# EAGLE design NanoHat-SPDIF (EAGLE 6.5.0)
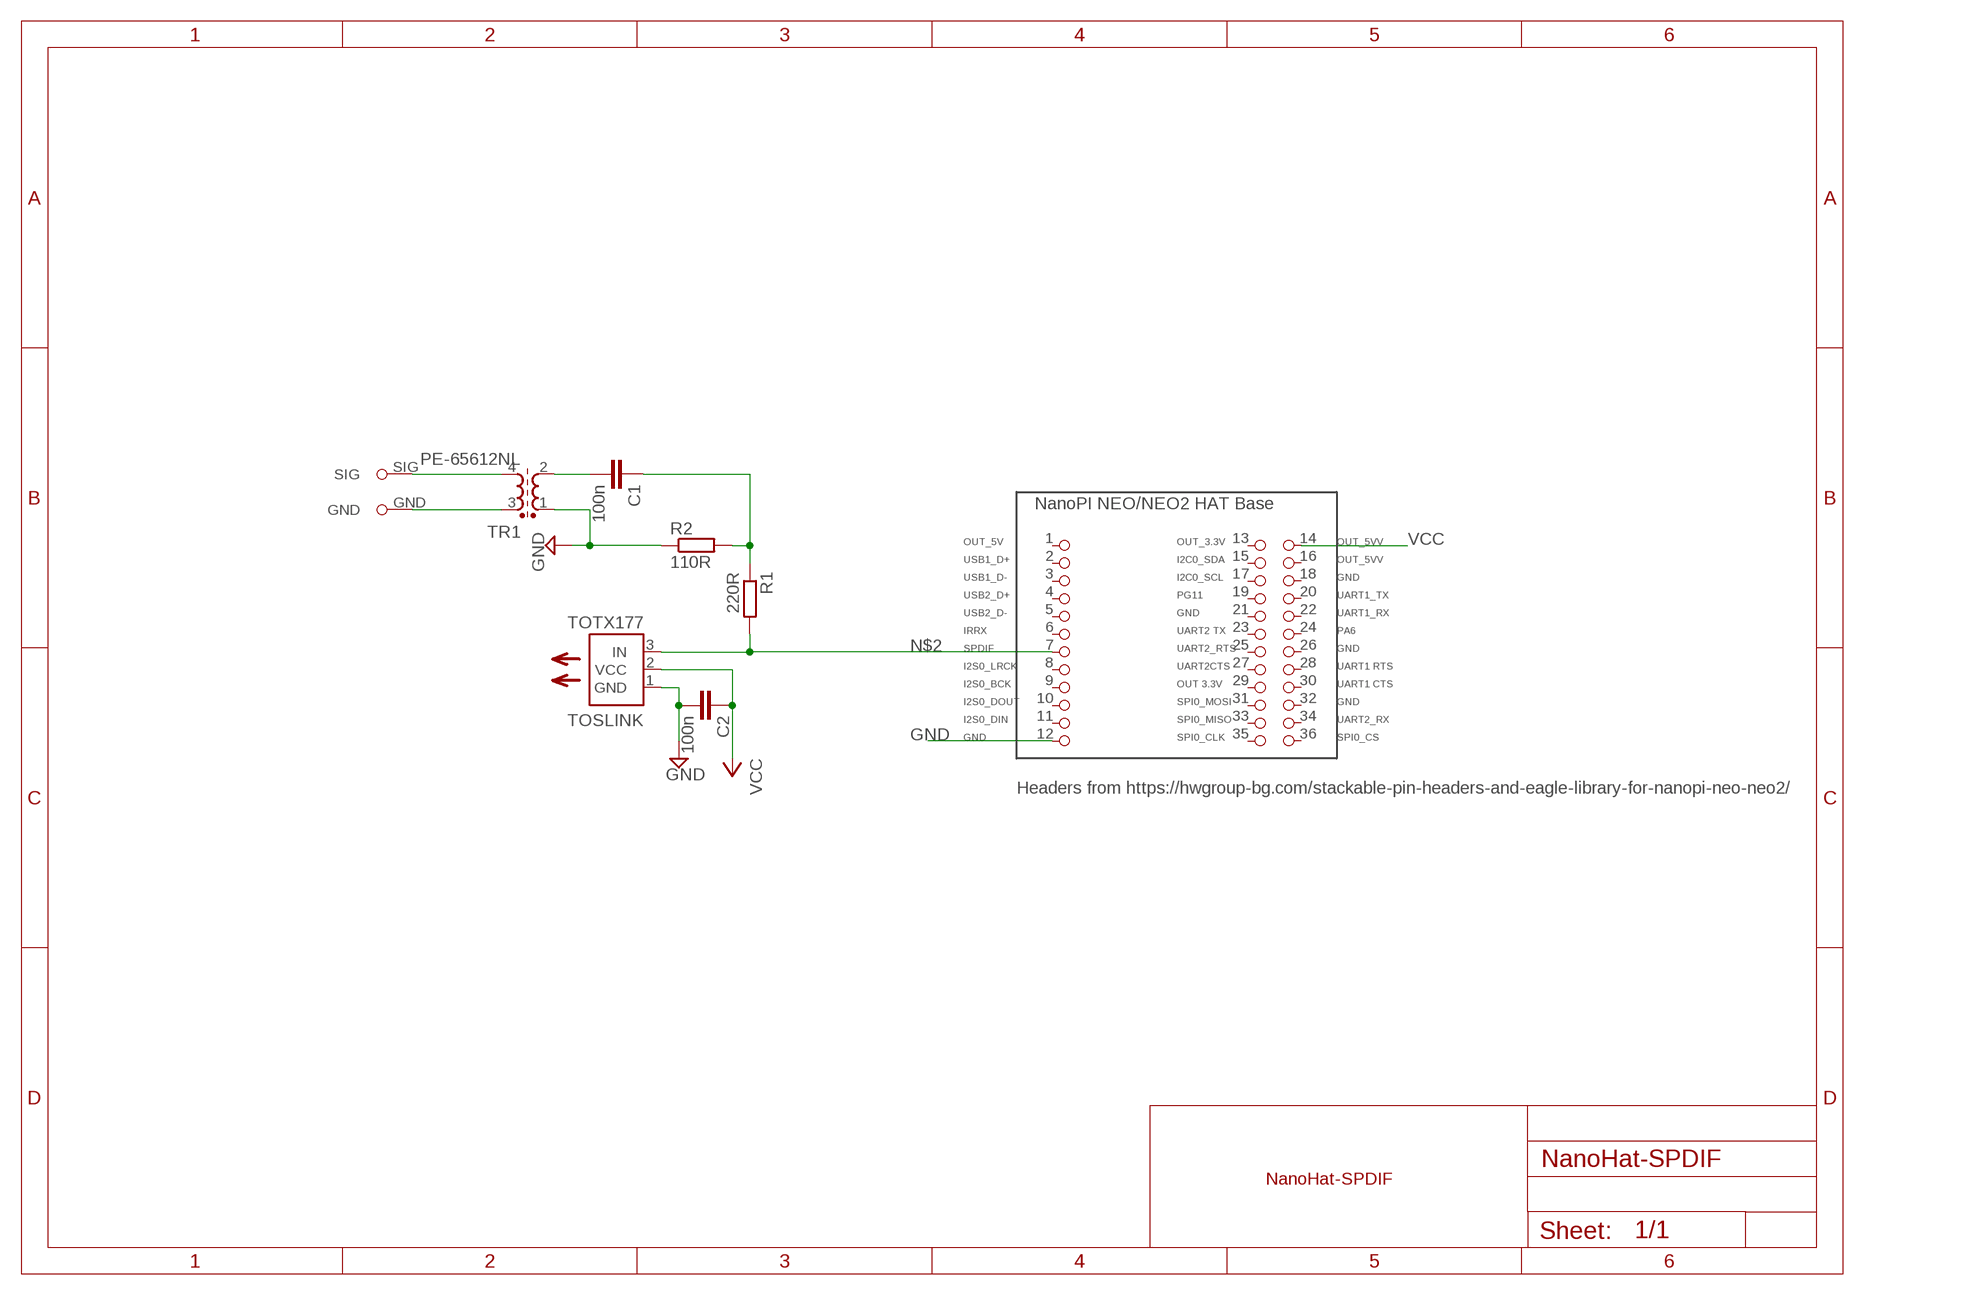
[diagram p0: schematic, sheet 1]

## Parts
C1  100n  C-EU025-024X044  [C025-024X044]
C2  100n  C-EU025-024X044  [C025-024X044]
R1  220R  R-EU_R0805  [R0805]
R2  110R  R-EU_R0805  [R0805]
TOSLINK  TOTX177  TOTX177(F,T)  [TOTX]
TR1  PE-65612NL  S22083  [S22083]
U$1  NANO  [NANOPI_NEO_HAT]
U$2  AV-8.4-5  [AUDIO]

## Nets
GND: C2.2 R2.1 TOSLINK.1(GND) TR1.1 U$1.12(GND_12)
GROUND: TR1.3 U$2.GND
N$1: C1.2 TR1.2
N$2: R1.2 TOSLINK.3(IN) U$1.7(SPDIF_P_7)
N$3: C1.1 R1.1 R2.2
SIG: TR1.4 U$2.SIG
VCC: C2.1 TOSLINK.2(VCC) U$1.14(OUT_5V_14)
Unconnected: U$1.1(OUT_5V_P1) U$1.2(USB_1_D+_2) U$1.3(USB_1_D-_3) U$1.4(USB_2_D+_4) U$1.5(USB_2_D-_5) U$1.6(IR_RX_6) U$1.8(LRCK_8) U$1.9(BCK_9) U$1.10(DOUT_10) U$1.11(DIN_11) U$1.13(OUT_3.3V_13) U$1.15(I2C0_SDA_15) U$1.16(OUT_5V_16) U$1.17(I2C0_SCL_17) U$1.18(GND_18) U$1.19(PG11_19) U$1.20(UART1_TX_20) U$1.21(GND_21) U$1.22(UART1_RX_22) U$1.23(UART2TX_23) U$1.24(PA6_24) U$1.25(UART2_RTS_25) U$1.26(GND26) U$1.27(UART2_CTS_27) U$1.28(UART1_RTS_28) U$1.29(3V3_29) U$1.30(UART1_CTS_30) U$1.31(MOSI_31) U$1.32(GND_32) U$1.33(SPI0_MISO_33) U$1.34(UART2_RX_34) U$1.35(SPI0_CLK_35) U$1.36(SPI_0_CS_36)

## Notes on the sheet
- Headers from https://hwgroup-bg.com/stackable-pin-headers-and-eagle-library-for-nanopi-neo-neo2/
- NanoHat-SPDIF

## Library data of the parts
C1 C2 = rcl:C-EU: CAPACITOR, European symbol
R1 R2 = rcl:R-EU_: RESISTOR, European symbol
TOSLINK = pavouk2lbr:TOTX177(F,T): FIBER OPTIC TRANSMITTING MODULE
TR1 = pavouk2lbr:S22083: Newava S22083 1:1 Pulse transformer
U$1 = nanopi_neo_hat:NANO: NanoPi NEO/NEO2 Hat Template; SPDIF: SPDIF
U$2 = AV-8.4-5-AUDIO-EAGLE:AV-8.4-5

## Board
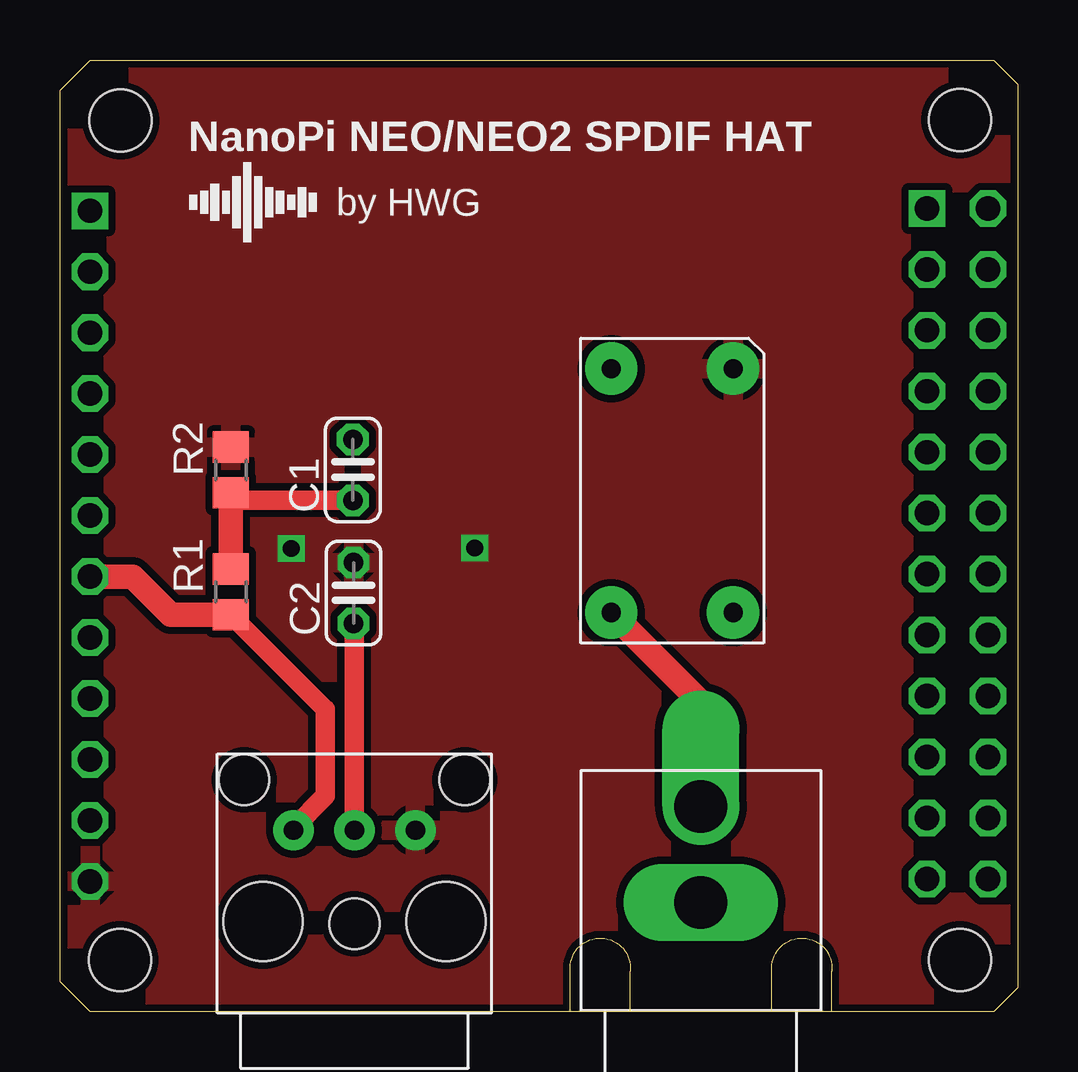
[diagram p1: board, top side]
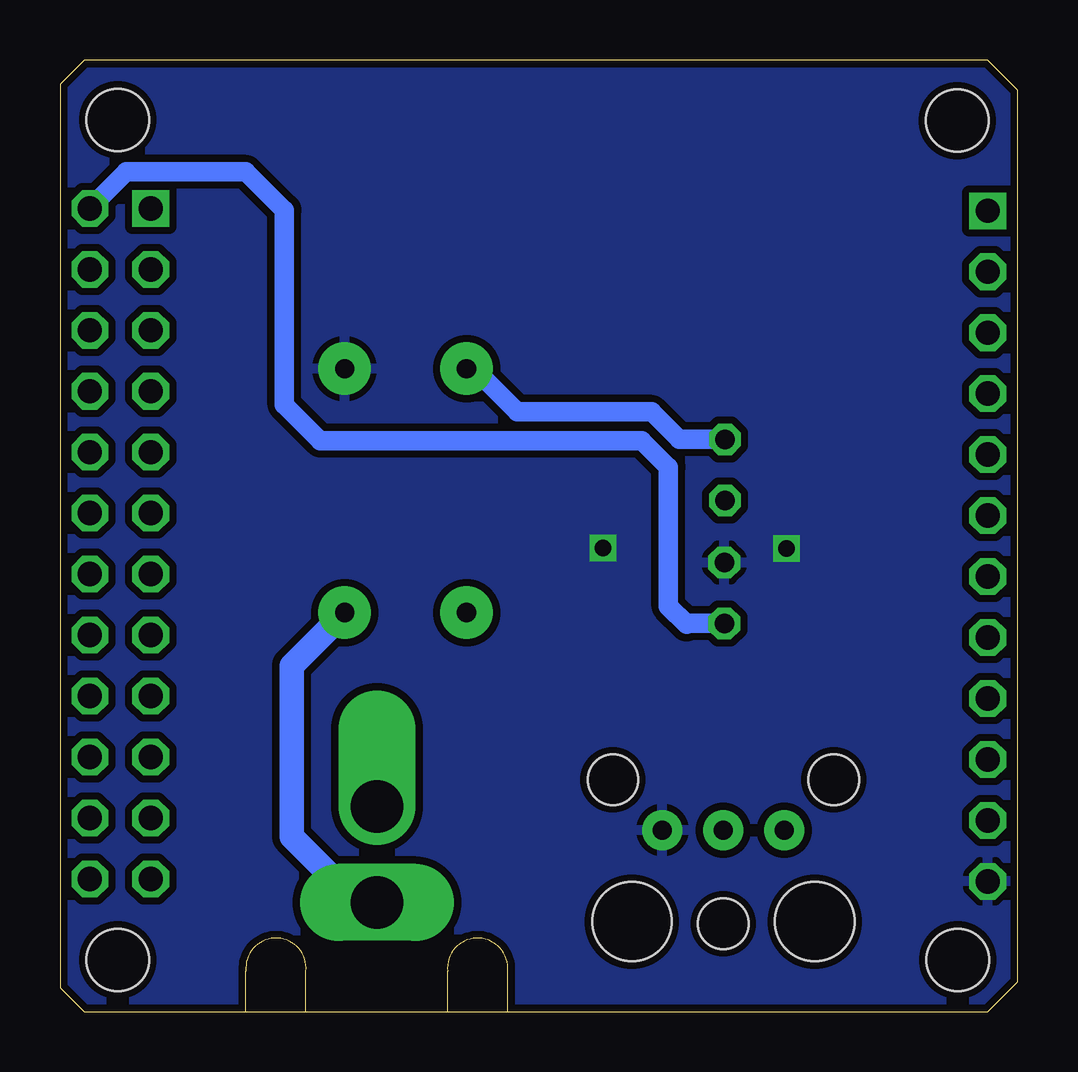
[diagram p2: board, bottom side, seen from below]

Size 39.91 x 39.66 mm. Coordinates in mm from the lower left corner, seen from the top.
Outline: 21.26,0 21.26,1.7 arc-191 23.76,1.7 23.76,0
Outline: 29.66,0 29.66,1.7 arc-191 32.16,1.7 32.16,0
Copper layers (1*16): Top 0.035mm / dielectric 1mm / Bottom 0.035mm
Design rules "default *": minimum track width 10mil, minimum drill 24mil, track to track 12mil, track to pad 12mil, pad to pad 12mil, via to via 12mil, smd to smd 10mil, copper to edge 12mil, drill to drill 8mil, minimum pad ring 10mil, minimum via ring 8mil, stop-mask expansion 4mil, vias tented up to drill 0mil, thermal gap 10mil
Holes 2.6 mm at 2.5,2.16 37.5,2.16 2.52,37.14 37.5,37.16

### Footprints (pad centres in the part's own frame; a part is rotated, then mirrored left to right if it is on the bottom)
C025-024X044 = drill 0.813 octagon: 1 -1.27,0; 2 1.27,0
R0805 = smd 1.3 x 1.5: 1 -0.95,0; 2 0.95,0
TOTX = drill 0.8 pad 1.676: 1 -3.81,2.54; 2 -3.81,0; 3 -3.81,-2.54 | hole 3.3: 0,-3.81; 0,3.81 | hole 2.1: 0.09,0; -5.91,4.6; -5.91,-4.6
S22083 = drill 0.8 pad 2.184: 1 -5.08,2.54; 2 -5.08,-2.54; 3 5.08,-2.54; 4 5.08,2.54
NANOPI_NEO_HAT = drill 1.016 square: 1 1.143,33.426; 13 36.017,33.528 | drill 1.016 octagon: 2 1.143,30.886; 3 1.143,28.346; 4 1.143,25.806; 5 1.143,23.266; 6 1.143,20.726; 7 1.143,18.186; 8 1.143,15.646; 9 1.143,13.106; 10 1.143,10.566; 11 1.143,8.026; 12 1.143,5.486; 14 38.557,33.528; 15 36.017,30.988; 16 38.557,30.988; 17 36.017,28.448; 18 38.557,28.448; 19 36.017,25.908; 20 38.557,25.908; 21 36.017,23.368; 22 38.557,23.368; 23 36.017,20.828; 24 38.557,20.828; 25 36.017,18.288; 26 38.557,18.288; 27 36.017,15.748; 28 38.557,15.748; 29 36.017,13.208; 30 38.557,13.208; 31 36.017,10.668; 32 38.557,10.668; 33 36.017,8.128; 34 38.557,8.128; 35 36.017,5.588; 36 38.557,5.588
AUDIO = drill 2.2 pad 2.54 offset: GND 4,17.5 | drill 2.2 pad 2.54 long: SIG 4,13.5

### Placement (x,y rotation side)
C1  12.2,22.58 90 top
C2  12.23,17.45 90 top
R1  7.12,17.5 270 top
R2  7.12,22.58 270 top
TOSLINK  12.27,3.76 270 top
TR1  25.51,21.72 270 top
U$1  0.11,-0.05 0 top
U$2  22.7,-8.94 0 top

### Tracks (layer width: path | path; a pad name or v marks a point on that pad's centre or on a via)
GND  (via drill 0.7)
  other vias: 9.64,19.3 17.28,19.33
  pour Top: 1.36,39.7 38.86,39.7 38.86,39.6 39.86,38.6 39.86,0.9 38.76,-0.2 1.36,-0.2 0.06,1.1 0.06,38.5 1.26,39.7
  pour Bottom: -0.02,38.25 -0.02,38.41 1.28,39.7 38.77,39.7 39.99,38.48 39.99,1.17 38.9,0.08 1.05,0.08 -0.02,1.14 -0.02,38.23
GROUND
  Top 1.016: U$2.GND 26.7,12.91 TR1.3
N$1
  Bottom 0.813: TR1.2 22.66,26.8 20.86,25 15.26,25 14.11,23.85 C1.2
N$2
  Top 0.813: TOSLINK.3 9.73,7.67 11.06,9 11.06,12.61 R1.2
  Top 1.016: R1.2 4.62,16.55 3.03,18.14 U$1.7
N$3
  Top 0.813: C1.1 7.44,21.31 R2.2
  Top 1.016: R1.1 R2.2
SIG
  Bottom 1.016: U$2.SIG 27.52,4.56 30.26,7.3 30.26,14.43 TR1.4
VCC
  Top 0.813: TOSLINK.2 12.27,16.14 C2.1
  Bottom 0.813: U$1.14 37.14,35 32.16,35 30.56,33.4 30.56,25.3 29.06,23.8 15.66,23.8 14.56,22.7 14.56,16.9 13.8,16.14 13.76,16.18 C2.1

### Text on the board
tNames: NanoPi NEO/NEO2 SPDIF HAT | by HWG